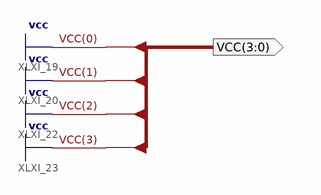
[diagram p0: schematic sheet 1]
// Xilinx ISE schematic vcc4.sch (spartan6) as structural Verilog: 0 symbols, 1 ports
module vcc4 (
  output [3:0] VCC
);


  assign VCC = 4'b1111;
endmodule
